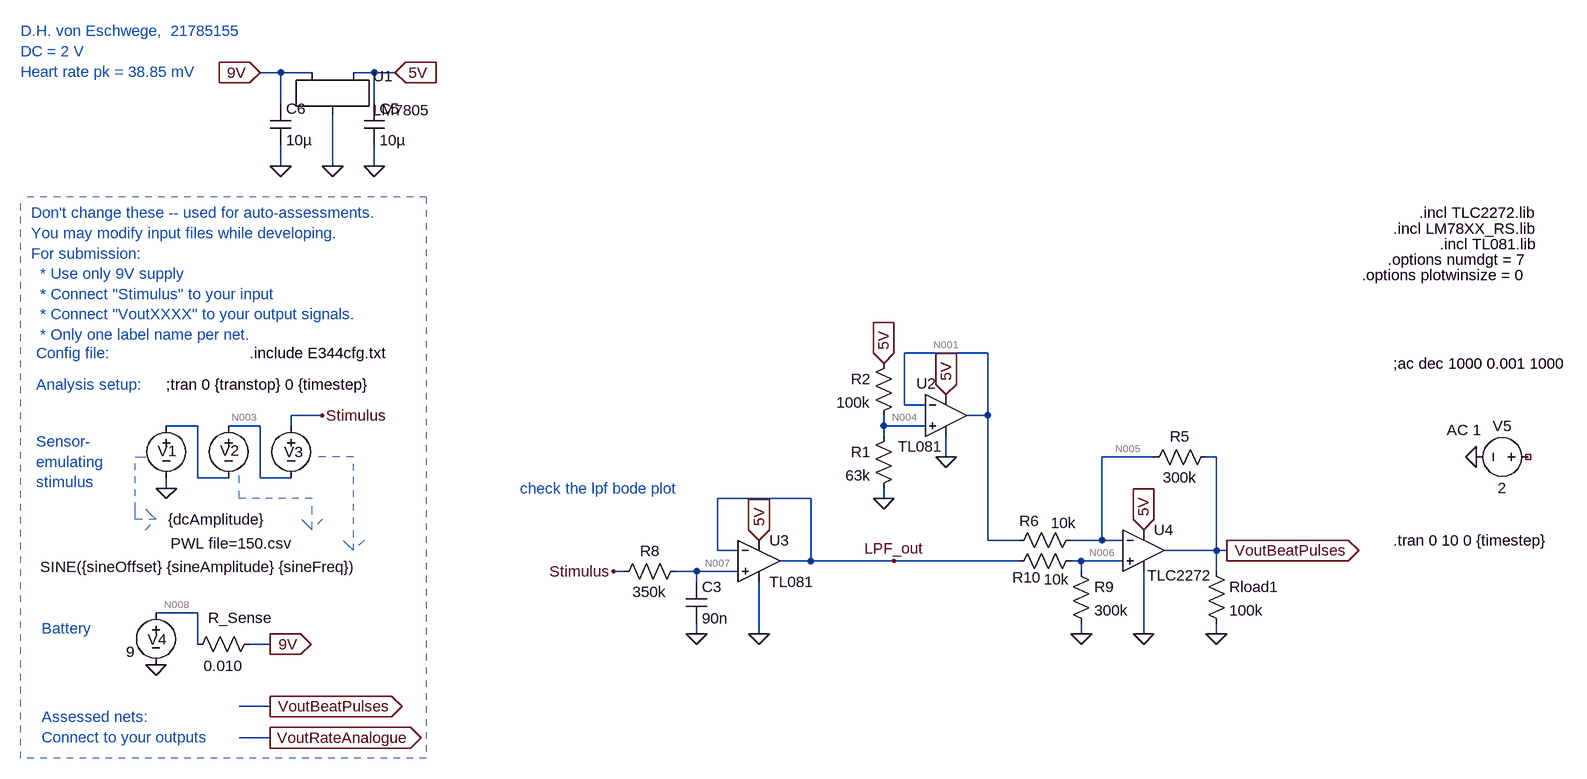
[diagram p0: schematic X_1stOrderFilter .asc]
X_1stOrderFilter .asc, the LTspice schematic file:
Version 4
SHEET 1 1824 680
WIRE -1904 -1600 -1936 -1600
WIRE -1856 -1600 -1904 -1600
WIRE -1760 -1600 -1792 -1600
WIRE -1728 -1600 -1760 -1600
WIRE -1904 -1552 -1904 -1600
WIRE -1760 -1552 -1760 -1600
WIRE -1904 -1456 -1904 -1488
WIRE -1824 -1456 -1824 -1536
WIRE -1760 -1456 -1760 -1488
WIRE -816 -1168 -944 -1168
WIRE -944 -1088 -944 -1168
WIRE -912 -1088 -944 -1088
WIRE -1840 -1072 -1888 -1072
WIRE -816 -1072 -816 -1168
WIRE -816 -1072 -848 -1072
WIRE -2032 -1056 -2080 -1056
WIRE -1936 -1056 -1984 -1056
WIRE -1888 -1056 -1888 -1072
WIRE -976 -1056 -976 -1072
WIRE -912 -1056 -976 -1056
WIRE -976 -1040 -976 -1056
WIRE -880 -1008 -880 -1040
WIRE -560 -1008 -640 -1008
WIRE -464 -1008 -480 -1008
WIRE -2032 -976 -2032 -1056
WIRE -1984 -976 -2032 -976
WIRE -1936 -976 -1936 -1056
WIRE -1888 -976 -1936 -976
WIRE -2080 -960 -2080 -976
WIRE -1088 -944 -1232 -944
WIRE -976 -944 -976 -960
WIRE -816 -880 -816 -1072
WIRE -768 -880 -816 -880
WIRE -640 -880 -640 -1008
WIRE -640 -880 -688 -880
WIRE -608 -880 -640 -880
WIRE -1232 -864 -1232 -944
WIRE -1200 -864 -1232 -864
WIRE -464 -864 -464 -1008
WIRE -464 -864 -544 -864
WIRE -448 -864 -464 -864
WIRE -1088 -848 -1088 -944
WIRE -1088 -848 -1136 -848
WIRE -960 -848 -1088 -848
WIRE -768 -848 -960 -848
WIRE -672 -848 -688 -848
WIRE -608 -848 -672 -848
WIRE -1376 -832 -1392 -832
WIRE -1264 -832 -1296 -832
WIRE -1200 -832 -1264 -832
WIRE -672 -832 -672 -848
WIRE -464 -832 -464 -864
WIRE -1264 -816 -1264 -832
WIRE -2032 -768 -2096 -768
WIRE -1264 -736 -1264 -752
WIRE -1168 -736 -1168 -816
WIRE -672 -736 -672 -752
WIRE -576 -736 -576 -832
WIRE -464 -736 -464 -752
WIRE -2032 -720 -2032 -768
WIRE -1920 -720 -1952 -720
WIRE -1920 -624 -1968 -624
WIRE -1920 -576 -1968 -576
FLAG -2080 -960 0
FLAG -1840 -1072 Stimulus
FLAG -1920 -720 9V
IOPIN -1920 -720 Out
FLAG -2096 -688 0
FLAG -1920 -624 VoutBeatPulses
IOPIN -1920 -624 Out
FLAG -1920 -576 VoutRateAnalogue
IOPIN -1920 -576 Out
FLAG -1824 -1456 0
FLAG -1168 -736 0
FLAG -1264 -736 0
FLAG -1936 -1600 9V
IOPIN -1936 -1600 In
FLAG -1904 -1456 0
FLAG -1760 -1456 0
FLAG -1728 -1600 5V
IOPIN -1728 -1600 In
FLAG -1168 -880 5V
IOPIN -1168 -880 In
FLAG -64 -1008 0
FLAG -448 -864 VoutBeatPulses
IOPIN -448 -864 Out
FLAG -1392 -832 Stimulus
FLAG -464 -736 0
FLAG -576 -736 0
FLAG -672 -736 0
FLAG -960 -848 LPF_out
FLAG -976 -944 0
FLAG -976 -1152 5V
IOPIN -976 -1152 In
FLAG -880 -1008 0
FLAG -576 -896 5V
IOPIN -576 -896 In
FLAG -880 -1104 5V
IOPIN -880 -1104 In
SYMBOL voltage -1984 -1072 R0
WINDOW 123 0 0 Left 0
WINDOW 39 0 0 Left 0
WINDOW 3 -89 197 Left 2
WINDOW 0 -13 54 Left 2
SYMATTR Value PWL file=150.csv
SYMATTR InstName V2
SYMBOL voltage -1888 -1072 R0
WINDOW 123 24 44 Left 2
WINDOW 39 0 0 Left 0
WINDOW 3 -386 233 Left 2
WINDOW 0 -11 56 Left 2
SYMATTR Value SINE({sineOffset} {sineAmplitude} {sineFreq})
SYMATTR InstName V3
SYMBOL voltage -2080 -1072 R0
WINDOW 123 0 0 Left 0
WINDOW 39 0 0 Left 0
WINDOW 3 3 160 Left 2
WINDOW 0 -13 55 Left 2
SYMATTR Value {dcAmplitude}
SYMATTR InstName V1
SYMBOL voltage -2096 -784 R0
WINDOW 123 24 44 Left 2
WINDOW 39 0 0 Left 0
WINDOW 3 -46 76 Left 2
WINDOW 0 -13 57 Left 2
SYMATTR Value 9
SYMATTR InstName V4
SYMBOL res -1936 -736 R90
WINDOW 0 -9 30 VBottom 2
WINDOW 3 34 56 VTop 2
SYMATTR InstName R_Sense
SYMATTR Value 0.010
SYMBOL LM7805 -1824 -1584 R0
SYMATTR InstName U1
SYMBOL cap -1280 -816 R0
SYMATTR InstName C3
SYMATTR Value 90n
SYMBOL Opamps\\opamp2 -1168 -912 R0
SYMATTR InstName U3
SYMATTR Value TL081
SYMBOL res -1280 -848 R90
WINDOW 0 0 56 VBottom 2
WINDOW 3 32 56 VTop 2
SYMATTR InstName R8
SYMATTR Value 350k
SYMBOL cap -1776 -1552 R0
SYMATTR InstName C5
SYMATTR Value 10µ
SYMBOL cap -1920 -1552 R0
SYMATTR InstName C6
SYMATTR Value 10µ
SYMBOL voltage 32 -1008 R90
WINDOW 0 -32 56 VBottom 2
WINDOW 3 32 56 VTop 2
WINDOW 123 -26 115 VBottom 2
WINDOW 39 0 0 Left 0
SYMATTR InstName V5
SYMATTR Value 2
SYMATTR Value2 AC 1
SYMBOL res -480 -848 R0
SYMATTR InstName Rload1
SYMATTR Value 100k
SYMBOL res -464 -1024 R90
WINDOW 0 0 56 VBottom 2
WINDOW 3 32 56 VTop 2
SYMATTR InstName R5
SYMATTR Value 300k
SYMBOL res -672 -896 R90
WINDOW 0 2 80 VBottom 2
WINDOW 3 -26 27 VTop 2
SYMATTR InstName R6
SYMATTR Value 10k
SYMBOL Opamps\\opamp2 -576 -928 R0
WINDOW 3 6 102 Left 2
SYMATTR Value TLC2272
SYMATTR InstName U4
SYMBOL res -688 -848 R0
SYMATTR InstName R9
SYMATTR Value 300k
SYMBOL res -672 -864 R90
WINDOW 0 57 84 VBottom 2
WINDOW 3 29 38 VTop 2
SYMATTR InstName R10
SYMATTR Value 10k
SYMBOL res -960 -1056 M0
SYMATTR InstName R1
SYMATTR Value 63k
SYMBOL res -960 -1168 M0
SYMATTR InstName R2
SYMATTR Value 100k
SYMBOL Opamps\\opamp2 -880 -1136 R0
WINDOW 0 -46 15 Left 2
WINDOW 3 -74 112 Left 2
SYMATTR InstName U2
SYMATTR Value TL081
TEXT -2080 -1120 Left 2 !;tran 0 {transtop} 0 {timestep}
TEXT -1952 -1168 Left 2 !.include E344cfg.txt
TEXT -2288 -1384 Left 2 ;Don't change these -- used for auto-assessments.\nYou may modify input files while developing.\nFor submission: \n  * Use only 9V supply \n  * Connect "Stimulus" to your input\n  * Connect "VoutXXXX" to your output signals.\n  * Only one label name per net.
TEXT -2280 -1168 Left 2 ;Config file:
TEXT -2280 -1120 Left 2 ;Analysis setup:
TEXT -2272 -744 Left 2 ;Battery
TEXT -2280 -1032 Left 2 ;Sensor-\nemulating \nstimulus
TEXT -2272 -608 Left 2 ;Assessed nets:\nConnect to your outputs
TEXT -2304 -1664 Left 2 ;D.H. von Eschwege,  21785155\nDC = 2 V\nHeart rate pk = 38.85 mV
TEXT -152 -1384 Left 2 !.incl TLC2272.lib
TEXT -192 -1360 Left 2 !.incl LM78XX_RS.lib
TEXT -120 -1336 Left 2 !.incl TL081.lib
TEXT -200 -1312 Left 2 !.options numdgt = 7
TEXT -240 -1288 Left 2 !.options plotwinsize = 0
TEXT -192 -1152 Left 2 !;ac dec 1000 0.001 1000
TEXT -192 -880 Left 2 !.tran 0 10 0 {timestep}
TEXT -1536 -960 Left 2 ;check the lpf bode plot
LINE Normal -1792 -1008 -1856 -1008 2
LINE Normal -1792 -864 -1792 -1008 2
LINE Normal -1808 -880 -1792 -864 2
LINE Normal -1792 -864 -1808 -880 2
LINE Normal -1776 -880 -1792 -864 2
LINE Normal -2128 -1008 -2112 -1008 2
LINE Normal -2128 -928 -2128 -1008 2
LINE Normal -2128 -912 -2128 -928 2
LINE Normal -2096 -912 -2128 -912 2
LINE Normal -2112 -928 -2096 -912 2
LINE Normal -2096 -912 -2112 -928 2
LINE Normal -2112 -896 -2096 -912 2
LINE Normal -1968 -944 -1968 -992 2
LINE Normal -1856 -944 -1968 -944 2
LINE Normal -1856 -896 -1856 -944 2
LINE Normal -1872 -912 -1856 -896 2
LINE Normal -1856 -896 -1872 -912 2
LINE Normal -1840 -912 -1856 -896 2
LINE Normal -2304 -544 -2304 -1408 1
LINE Normal -1680 -1408 -1680 -544 1
LINE Normal -1680 -544 -2304 -544 1
LINE Normal -1680 -1408 -2304 -1408 1

The netlist it stands for:
* X_1stOrderFilter .asc
V2 N003 N002 PWL file=150.csv
V3 Stimulus N003 SINE({sineOffset} {sineAmplitude} {sineFreq})
V1 N002 0 {dcAmplitude}
V4 N008 0 9
R_Sense 9V N008 0.010
XU1 9V 0 5V LM7805
C3 N007 0 90n
XU3 N007 LPF_out 5V 0 LPF_out TL081  ; pins In+ In- V+ V- OUT
R8 N007 Stimulus 350k
C5 5V 0 10µ
C6 9V 0 10µ
V5 NC_01 0 2 AC 1
Rload1 VoutBeatPulses 0 100k
R5 VoutBeatPulses N005 300k
R6 N005 N001 10k
XU4 N006 N005 5V 0 VoutBeatPulses TLC2272  ; pins In+ In- V+ V- OUT
R9 N006 0 300k
R10 N006 LPF_out 10k
R1 N004 0 63k
R2 5V N004 100k
XU2 N004 N001 5V 0 N001 TL081  ; pins In+ In- V+ V- OUT
;tran 0 {transtop} 0 {timestep}
.include E344cfg.txt
* Don't change these -- used for auto-assessments.
* You may modify input files while developing.
* For submission:
*   * Use only 9V supply
*   * Connect "Stimulus" to your input
*   * Connect "VoutXXXX" to your output signals.
*   * Only one label name per net.
* Config file:
* Analysis setup:
* Battery
* Sensor-
* emulating
* stimulus
* Assessed nets:
* Connect to your outputs
* D.H. von Eschwege,  21785155
* DC = 2 V
* Heart rate pk = 38.85 mV
.incl TLC2272.lib
.incl LM78XX_RS.lib
.incl TL081.lib
.options numdgt = 7
.options plotwinsize = 0
;ac dec 1000 0.001 1000
.tran 0 10 0 {timestep}
* check the lpf bode plot
.backanno
.end

* Results of the author's LTspice run, read from the files saved beside the schematic
* Operating Point, zero values left out:
*   V(n003) = 1.999 V
*   V(stimulus) = 1.999 V
*   V(n008) = 9 V
*   V(9v) = 9 V
*   V(5v) = 5.003 V
*   V(n007) = 1.999 V
*   V(lpf_out) = 1.999 V
*   V(voutbeatpulses) = 1.974 V
*   V(n005) = 1.935 V
*   V(n001) = 1.934 V
*   V(n006) = 1.935 V
*   V(n004) = 1.934 V
*   I(R2) = 30.69 µA
*   I(R1) = 30.69 µA
*   I(R10) = -6.449 µA
*   I(R9) = 6.448 µA
*   I(R6) = 129 nA
*   I(R5) = 129 nA
*   I(Rload1) = 19.74 µA
*   I(R8) = -32.05 pA
*   I(R_sense) = -12.53 mA
*   I(V4) = -12.53 mA
*   I(V1) = -32.05 pA
*   I(V3) = -32.05 pA
*   I(V2) = -32.05 pA